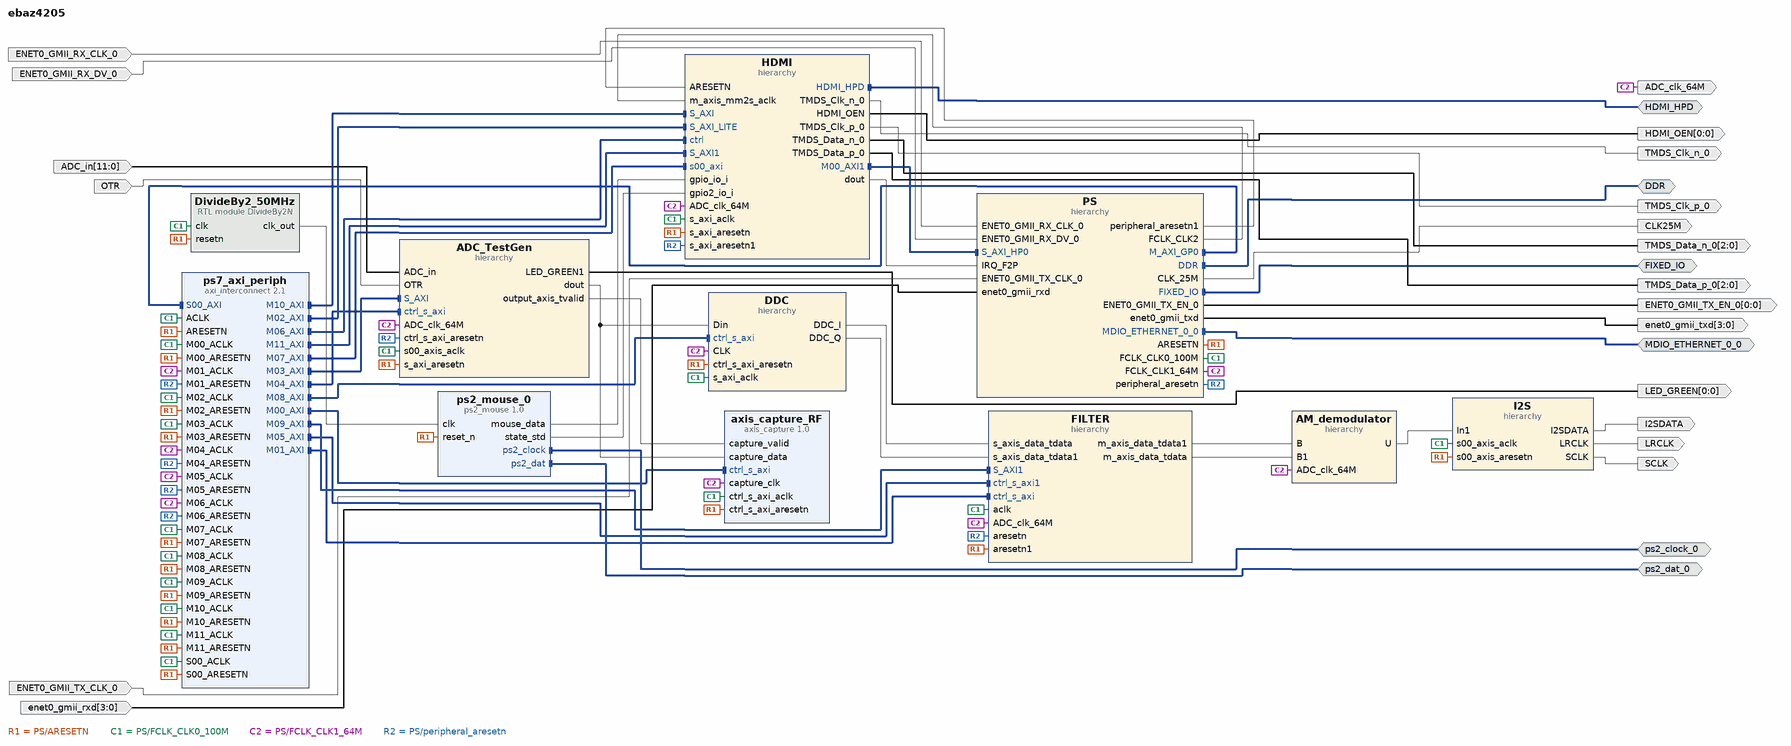
[diagram p0: block diagram of the top level]
# Vivado block design ebaz4205, xc7z010clg400-1, Vivado 2022.2
create_bd_design ebaz4205

create_bd_intf_port -mode Master -vlnv xilinx.com:interface:ddrx_rtl:1.0 DDR
create_bd_intf_port -mode Master -vlnv xilinx.com:display_processing_system7:fixedio_rtl:1.0 FIXED_IO
create_bd_intf_port -mode Master -vlnv xilinx.com:interface:mdio_rtl:1.0 MDIO_ETHERNET_0_0
create_bd_intf_port -mode Master -vlnv xilinx.com:interface:gpio_rtl:1.0 HDMI_HPD
create_bd_intf_port -mode Master -vlnv xilinx.com:interface:gpio_rtl:1.0 ps2_clock_0
create_bd_intf_port -mode Master -vlnv xilinx.com:interface:gpio_rtl:1.0 ps2_dat_0
create_bd_port -dir I -type clk ENET0_GMII_RX_CLK_0
create_bd_port -dir I ENET0_GMII_RX_DV_0
create_bd_port -dir I -type clk ENET0_GMII_TX_CLK_0
create_bd_port -dir O -from 0 -to 0 ENET0_GMII_TX_EN_0
create_bd_port -dir I -from 3 -to 0 enet0_gmii_rxd
create_bd_port -dir O -from 3 -to 0 enet0_gmii_txd
create_bd_port -dir O -type clk CLK25M
set_property -dict {CONFIG.FREQ_HZ 25000000} [get_bd_ports CLK25M]
create_bd_port -dir O -type clk ADC_clk_64M
set_property -dict {CONFIG.FREQ_HZ 64000000} [get_bd_ports ADC_clk_64M]
create_bd_port -dir I -type data OTR
create_bd_port -dir I -from 11 -to 0 -type data ADC_in
create_bd_port -dir O SCLK
create_bd_port -dir O LRCLK
create_bd_port -dir O I2SDATA
create_bd_port -dir O -from 0 -to 0 -type data LED_GREEN
create_bd_port -dir O -from 0 -to 0 HDMI_OEN
create_bd_port -dir O TMDS_Clk_p_0
create_bd_port -dir O TMDS_Clk_n_0
create_bd_port -dir O -from 2 -to 0 TMDS_Data_p_0
create_bd_port -dir O -from 2 -to 0 TMDS_Data_n_0

create_bd_cell -type hier PS
create_bd_cell -type hier ADC_TestGen
create_bd_cell -type hier DDC
create_bd_cell -type hier AM_demodulator
create_bd_cell -type hier FILTER
create_bd_cell -type hier I2S
create_bd_cell -type module -reference DivideBy2N DivideBy2_50MHz
set_property -dict {CONFIG.N 1 CONFIG.WIDTH 2} [get_bd_cells DivideBy2_50MHz]
create_bd_cell -type hier HDMI
create_bd_cell -type ip -vlnv xilinx.com:ip:axi_interconnect:2.1 ps7_axi_periph
set_property -dict [list \
  CONFIG.ENABLE_ADVANCED_OPTIONS 0 \
  CONFIG.NUM_MI 12 \
  CONFIG.NUM_SI 1 \
  CONFIG.STRATEGY 1 \
] [get_bd_cells ps7_axi_periph]
create_bd_cell -type ip -vlnv xilinx.com:user:axis_capture:1.0 axis_capture_RF
set_property -dict {CONFIG.C_CAPTURE_NUM_WORDS_EXP2 14} [get_bd_cells axis_capture_RF]
create_bd_cell -type ip -vlnv xilinx.com:user:ps2_mouse:1.0 ps2_mouse_0

# ---- hierarchy /PS ----
current_bd_instance /PS
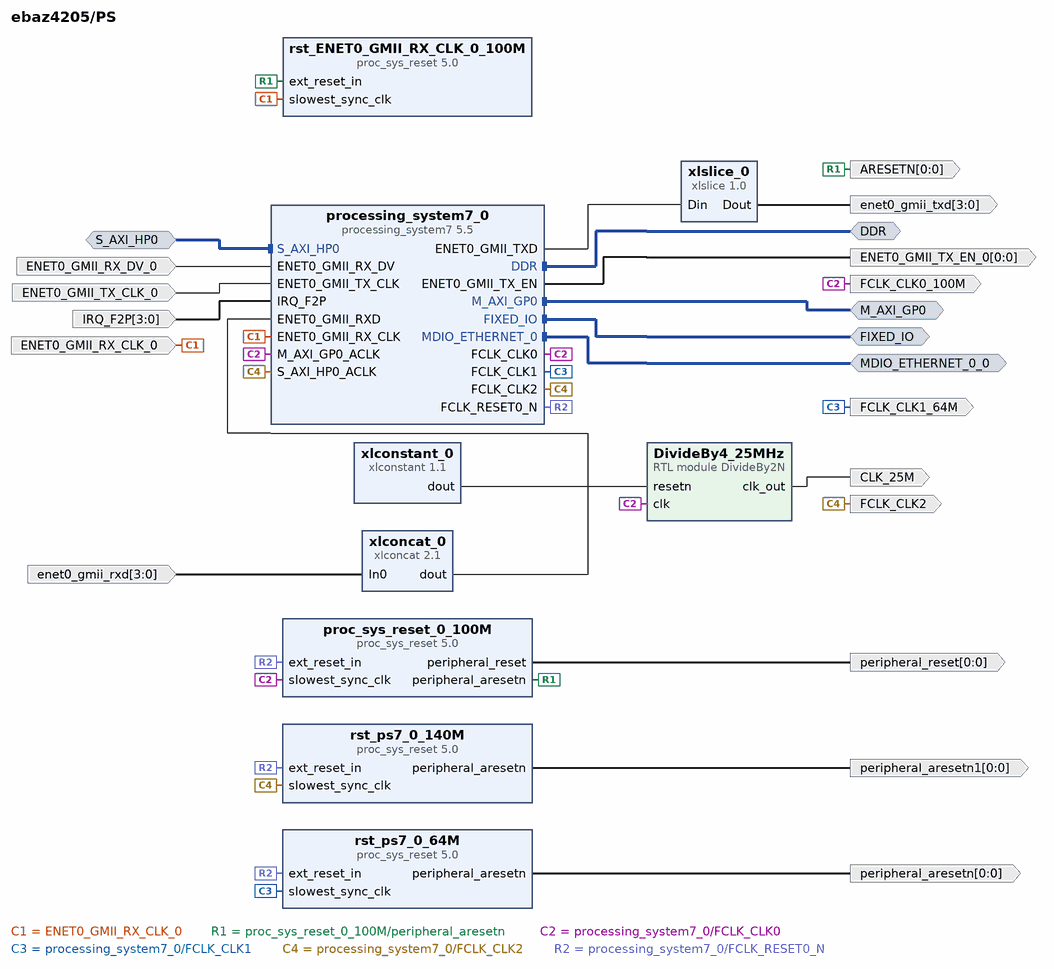
[diagram p1: block diagram inside /PS]
create_bd_intf_pin -mode Master -vlnv xilinx.com:interface:mdio_rtl:1.0 MDIO_ETHERNET_0_0
create_bd_intf_pin -mode Master -vlnv xilinx.com:interface:ddrx_rtl:1.0 DDR
create_bd_intf_pin -mode Master -vlnv xilinx.com:display_processing_system7:fixedio_rtl:1.0 FIXED_IO
create_bd_intf_pin -mode Slave -vlnv xilinx.com:interface:aximm_rtl:1.0 S_AXI_HP0
create_bd_intf_pin -mode Master -vlnv xilinx.com:interface:aximm_rtl:1.0 M_AXI_GP0
create_bd_pin -dir O -from 0 -to 0 ENET0_GMII_TX_EN_0
create_bd_pin -dir I -type clk ENET0_GMII_RX_CLK_0
create_bd_pin -dir I ENET0_GMII_RX_DV_0
create_bd_pin -dir I -type clk ENET0_GMII_TX_CLK_0
create_bd_pin -dir O -type clk FCLK_CLK0_100M
create_bd_pin -dir O -type clk CLK_25M
create_bd_pin -dir O -from 3 -to 0 enet0_gmii_txd
create_bd_pin -dir O -from 0 -to 0 -type rst ARESETN
create_bd_pin -dir I -from 3 -to 0 enet0_gmii_rxd
create_bd_pin -dir O -type clk FCLK_CLK1_64M
create_bd_pin -dir O -from 0 -to 0 -type rst peripheral_reset
create_bd_pin -dir O -from 0 -to 0 -type rst peripheral_aresetn
create_bd_pin -dir O -type clk FCLK_CLK2
create_bd_pin -dir O -from 0 -to 0 -type rst peripheral_aresetn1
create_bd_pin -dir I -from 3 -to 0 -type intr IRQ_F2P

create_bd_cell -type ip -vlnv xilinx.com:ip:xlslice:1.0 xlslice_0
set_property -dict {CONFIG.DIN_FROM 3 CONFIG.DIN_TO 0 CONFIG.DIN_WIDTH 8 CONFIG.DOUT_WIDTH 4} [get_bd_cells xlslice_0]
create_bd_cell -type ip -vlnv xilinx.com:ip:proc_sys_reset:5.0 proc_sys_reset_0_100M
create_bd_cell -type ip -vlnv xilinx.com:ip:processing_system7:5.5 processing_system7_0
set_property -dict [list \
  CONFIG.PCW_ENET0_ENET0_IO EMIO \
  CONFIG.PCW_ENET0_GRP_MDIO_ENABLE 1 \
  CONFIG.PCW_ENET0_GRP_MDIO_IO EMIO \
  CONFIG.PCW_ENET0_PERIPHERAL_ENABLE 1 \
  CONFIG.PCW_ENET0_PERIPHERAL_FREQMHZ {100 Mbps} \
  CONFIG.PCW_ENET0_RESET_ENABLE 0 \
  CONFIG.PCW_ENET_RESET_ENABLE 1 \
  CONFIG.PCW_ENET_RESET_SELECT {Share reset pin} \
  CONFIG.PCW_EN_CLK1_PORT 1 \
  CONFIG.PCW_EN_CLK2_PORT 1 \
  CONFIG.PCW_EN_CLK3_PORT 1 \
  CONFIG.PCW_FCLK_CLK1_BUF TRUE \
  CONFIG.PCW_FCLK_CLK2_BUF TRUE \
  CONFIG.PCW_FCLK_CLK3_BUF TRUE \
  CONFIG.PCW_FPGA0_PERIPHERAL_FREQMHZ 100 \
  CONFIG.PCW_FPGA1_PERIPHERAL_FREQMHZ 64 \
  CONFIG.PCW_FPGA2_PERIPHERAL_FREQMHZ 142 \
  CONFIG.PCW_FPGA3_PERIPHERAL_FREQMHZ 25 \
  CONFIG.PCW_FPGA_FCLK1_ENABLE 1 \
  CONFIG.PCW_FPGA_FCLK2_ENABLE 1 \
  CONFIG.PCW_FPGA_FCLK3_ENABLE 1 \
  CONFIG.PCW_GPIO_EMIO_GPIO_ENABLE 1 \
  CONFIG.PCW_GPIO_EMIO_GPIO_IO 64 \
  CONFIG.PCW_GPIO_MIO_GPIO_ENABLE 1 \
  CONFIG.PCW_GPIO_MIO_GPIO_IO MIO \
  CONFIG.PCW_I2C_RESET_ENABLE 1 \
  CONFIG.PCW_IRQ_F2P_INTR 1 \
  CONFIG.PCW_NAND_NAND_IO {MIO 0 2.. 14} \
  CONFIG.PCW_NAND_PERIPHERAL_ENABLE 1 \
  CONFIG.PCW_SD0_GRP_CD_ENABLE 1 \
  CONFIG.PCW_SD0_GRP_CD_IO {MIO 34} \
  CONFIG.PCW_SD0_GRP_WP_ENABLE 0 \
  CONFIG.PCW_SD0_PERIPHERAL_ENABLE 1 \
  CONFIG.PCW_SD0_SD0_IO {MIO 40 .. 45} \
  CONFIG.PCW_SDIO_PERIPHERAL_FREQMHZ 25 \
  CONFIG.PCW_UART1_PERIPHERAL_ENABLE 1 \
  CONFIG.PCW_UART1_UART1_IO {MIO 24 .. 25} \
  CONFIG.PCW_UART_PERIPHERAL_FREQMHZ 100 \
  CONFIG.PCW_UIPARAM_DDR_BUS_WIDTH {16 Bit} \
  CONFIG.PCW_UIPARAM_DDR_PARTNO {MT41K128M16 JT-125} \
  CONFIG.PCW_USB_RESET_ENABLE 1 \
  CONFIG.PCW_USE_FABRIC_INTERRUPT 1 \
  CONFIG.PCW_USE_S_AXI_HP0 1 \
] [get_bd_cells processing_system7_0]
# 212 more settings of processing_system7_0 are not shown: defaults, MIO pin electricals, DDR timing, and values the tool derives
create_bd_cell -type ip -vlnv xilinx.com:ip:xlconcat:2.1 xlconcat_0
set_property -dict {CONFIG.IN0_WIDTH 4 CONFIG.IN1_WIDTH 4 CONFIG.NUM_PORTS 2} [get_bd_cells xlconcat_0]
create_bd_cell -type ip -vlnv xilinx.com:ip:proc_sys_reset:5.0 rst_ENET0_GMII_RX_CLK_0_100M
create_bd_cell -type module -reference DivideBy2N DivideBy4_25MHz
set_property -dict {CONFIG.N 2 CONFIG.WIDTH 2} [get_bd_cells DivideBy4_25MHz]
create_bd_cell -type ip -vlnv xilinx.com:ip:proc_sys_reset:5.0 rst_ps7_0_64M
create_bd_cell -type ip -vlnv xilinx.com:ip:proc_sys_reset:5.0 rst_ps7_0_140M
create_bd_cell -type ip -vlnv xilinx.com:ip:xlconstant:1.1 xlconstant_0

# ---- hierarchy /ADC_TestGen ----
current_bd_instance /ADC_TestGen
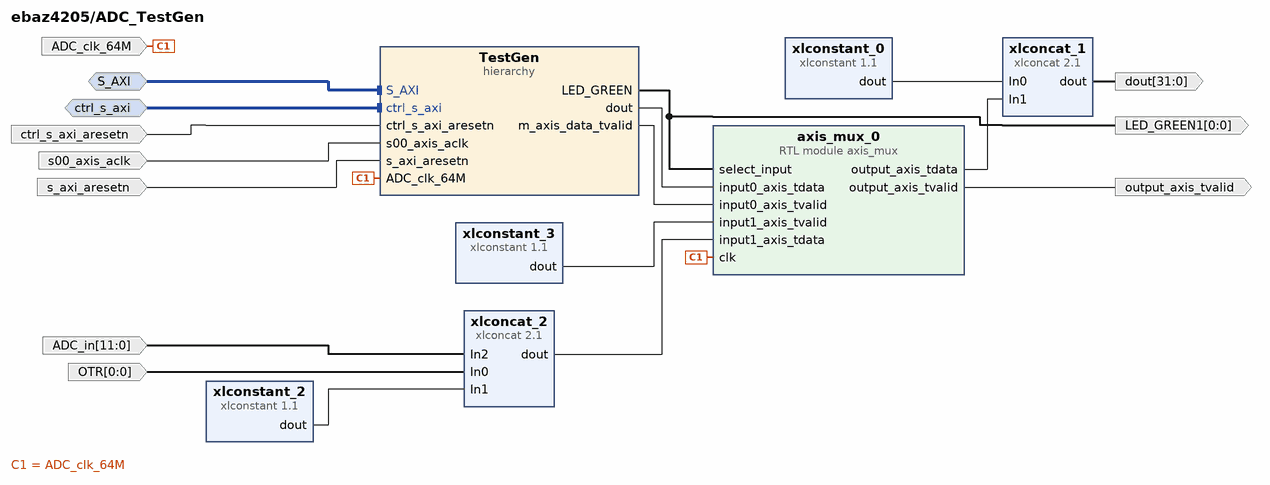
[diagram p2: block diagram inside /ADC_TestGen]
create_bd_intf_pin -mode Slave -vlnv xilinx.com:interface:aximm_rtl:1.0 S_AXI
create_bd_intf_pin -mode Slave -vlnv xilinx.com:interface:aximm_rtl:1.0 ctrl_s_axi
create_bd_pin -dir O -from 31 -to 0 dout
create_bd_pin -dir O output_axis_tvalid
create_bd_pin -dir I -type clk ADC_clk_64M
create_bd_pin -dir I -from 0 -to 0 -type data OTR
create_bd_pin -dir I -from 11 -to 0 -type data ADC_in
create_bd_pin -dir I -type clk s00_axis_aclk
create_bd_pin -dir I -type rst s_axi_aresetn
create_bd_pin -dir O -from 0 -to 0 LED_GREEN1
create_bd_pin -dir I -type rst ctrl_s_axi_aresetn

create_bd_cell -type ip -vlnv xilinx.com:ip:xlconcat:2.1 xlconcat_1
set_property -dict {CONFIG.IN0_WIDTH 16 CONFIG.IN1_WIDTH 16} [get_bd_cells xlconcat_1]
create_bd_cell -type module -reference axis_mux axis_mux_0
create_bd_cell -type ip -vlnv xilinx.com:ip:xlconcat:2.1 xlconcat_2
set_property -dict {CONFIG.IN0_WIDTH 1 CONFIG.IN1_WIDTH 3 CONFIG.IN2_WIDTH 12 CONFIG.NUM_PORTS 3} [get_bd_cells xlconcat_2]
create_bd_cell -type hier TestGen
create_bd_cell -type ip -vlnv xilinx.com:ip:xlconstant:1.1 xlconstant_0
set_property -dict {CONFIG.CONST_VAL 0 CONFIG.CONST_WIDTH 16} [get_bd_cells xlconstant_0]
create_bd_cell -type ip -vlnv xilinx.com:ip:xlconstant:1.1 xlconstant_3
set_property -dict {CONFIG.CONST_VAL 1 CONFIG.CONST_WIDTH 1} [get_bd_cells xlconstant_3]
create_bd_cell -type ip -vlnv xilinx.com:ip:xlconstant:1.1 xlconstant_2
set_property -dict {CONFIG.CONST_VAL b000 CONFIG.CONST_WIDTH 3} [get_bd_cells xlconstant_2]

# ---- hierarchy /ADC_TestGen/TestGen ----
current_bd_instance /ADC_TestGen/TestGen
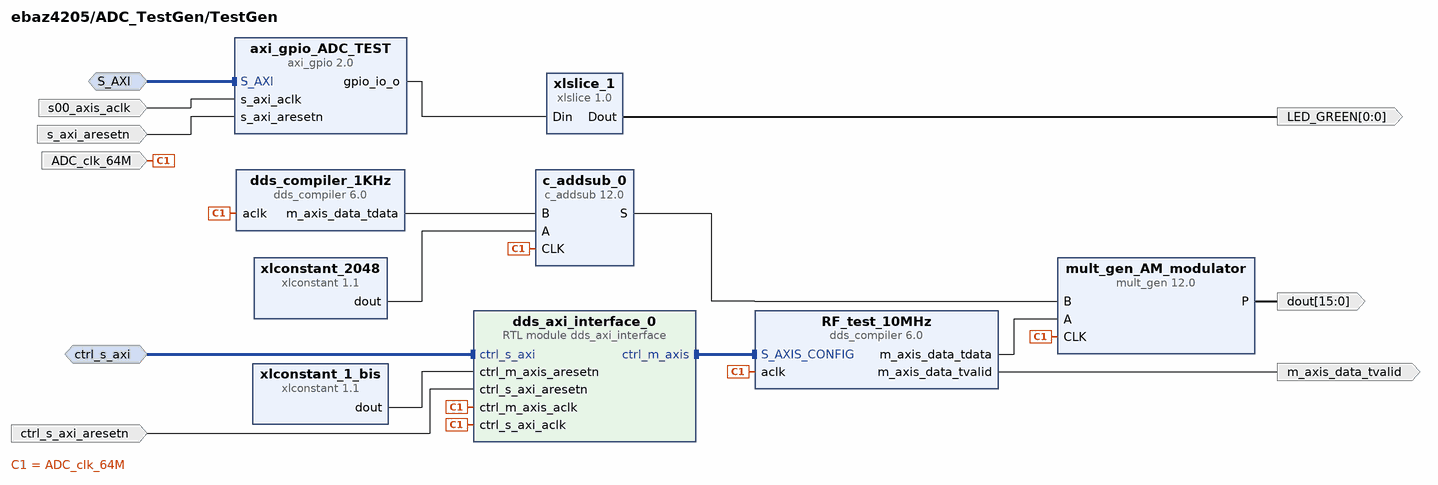
[diagram p3: block diagram inside /ADC_TestGen/TestGen]
create_bd_intf_pin -mode Slave -vlnv xilinx.com:interface:aximm_rtl:1.0 S_AXI
create_bd_intf_pin -mode Slave -vlnv xilinx.com:interface:aximm_rtl:1.0 ctrl_s_axi
create_bd_pin -dir I -type clk ADC_clk_64M
create_bd_pin -dir O m_axis_data_tvalid
create_bd_pin -dir I -type clk s00_axis_aclk
create_bd_pin -dir O -from 15 -to 0 dout
create_bd_pin -dir I -type rst s_axi_aresetn
create_bd_pin -dir O -from 0 -to 0 LED_GREEN
create_bd_pin -dir I -type rst ctrl_s_axi_aresetn

create_bd_cell -type ip -vlnv xilinx.com:ip:c_addsub:12.0 c_addsub_0
set_property -dict [list \
  CONFIG.A_Width 16 \
  CONFIG.B_Value 0000000000000000 \
  CONFIG.B_Width 16 \
  CONFIG.CE false \
  CONFIG.Latency 1 \
  CONFIG.Out_Width 16 \
] [get_bd_cells c_addsub_0]
create_bd_cell -type module -reference dds_axi_interface dds_axi_interface_0
create_bd_cell -type ip -vlnv xilinx.com:ip:xlslice:1.0 xlslice_1
create_bd_cell -type ip -vlnv xilinx.com:ip:axi_gpio:2.0 axi_gpio_ADC_TEST
set_property -dict [list \
  CONFIG.C_ALL_OUTPUTS 1 \
  CONFIG.C_DOUT_DEFAULT 0x00000000 \
  CONFIG.C_GPIO_WIDTH 32 \
  CONFIG.C_IS_DUAL 0 \
] [get_bd_cells axi_gpio_ADC_TEST]
create_bd_cell -type ip -vlnv xilinx.com:ip:dds_compiler:6.0 RF_test_10MHz
set_property -dict [list \
  CONFIG.DATA_Has_TLAST Not_Required \
  CONFIG.DDS_Clock_Rate 64 \
  CONFIG.Frequency_Resolution 1 \
  CONFIG.Has_Phase_Out false \
  CONFIG.Latency 7 \
  CONFIG.M_DATA_Has_TUSER Not_Required \
  CONFIG.Noise_Shaping Auto \
  CONFIG.OUTPUT_FORM Twos_Complement \
  CONFIG.Output_Frequency1 10 \
  CONFIG.Output_Selection Sine \
  CONFIG.Output_Width 12 \
  CONFIG.PINC1 101000000000000000000000 \
  CONFIG.Parameter_Entry System_Parameters \
  CONFIG.Phase_Increment Programmable \
  CONFIG.Phase_Width 26 \
  CONFIG.Phase_offset None \
  CONFIG.S_PHASE_Has_TUSER Not_Required \
  CONFIG.Spurious_Free_Dynamic_Range 70 \
] [get_bd_cells RF_test_10MHz]
create_bd_cell -type ip -vlnv xilinx.com:ip:dds_compiler:6.0 dds_compiler_1KHz
set_property -dict [list \
  CONFIG.Amplitude_Mode Full_Range \
  CONFIG.DDS_Clock_Rate 64 \
  CONFIG.Frequency_Resolution 0.4 \
  CONFIG.Has_Phase_Out false \
  CONFIG.Latency 7 \
  CONFIG.M_DATA_Has_TUSER Not_Required \
  CONFIG.Noise_Shaping Auto \
  CONFIG.Output_Frequency1 0.001 \
  CONFIG.Output_Selection Sine \
  CONFIG.Output_Width 12 \
  CONFIG.PINC1 1000001100010 \
  CONFIG.Parameter_Entry System_Parameters \
  CONFIG.Phase_Width 28 \
  CONFIG.Spurious_Free_Dynamic_Range 70 \
] [get_bd_cells dds_compiler_1KHz]
create_bd_cell -type ip -vlnv xilinx.com:ip:mult_gen:12.0 mult_gen_AM_modulator
set_property -dict [list \
  CONFIG.OptGoal Area \
  CONFIG.OutputWidthHigh 24 \
  CONFIG.OutputWidthLow 9 \
  CONFIG.PortAWidth 16 \
  CONFIG.PortBWidth 16 \
  CONFIG.Use_Custom_Output_Width true \
] [get_bd_cells mult_gen_AM_modulator]
create_bd_cell -type ip -vlnv xilinx.com:ip:xlconstant:1.1 xlconstant_1_bis
create_bd_cell -type ip -vlnv xilinx.com:ip:xlconstant:1.1 xlconstant_2048
set_property -dict {CONFIG.CONST_VAL 2048 CONFIG.CONST_WIDTH 16} [get_bd_cells xlconstant_2048]

# ---- hierarchy /DDC ----
current_bd_instance /DDC
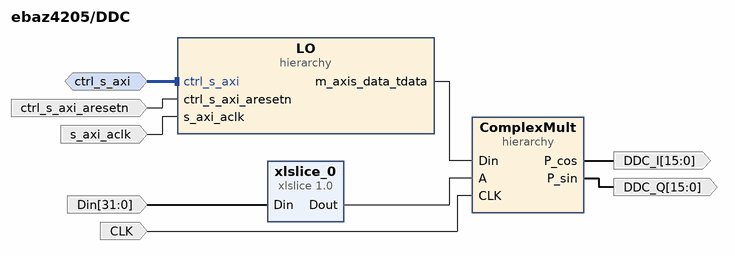
[diagram p4: block diagram inside /DDC]
create_bd_intf_pin -mode Slave -vlnv xilinx.com:interface:aximm_rtl:1.0 ctrl_s_axi
create_bd_pin -dir I -type clk CLK
create_bd_pin -dir O -from 15 -to 0 -type data DDC_I
create_bd_pin -dir O -from 15 -to 0 -type data DDC_Q
create_bd_pin -dir I -from 31 -to 0 Din
create_bd_pin -dir I -type clk s_axi_aclk
create_bd_pin -dir I -type rst ctrl_s_axi_aresetn

create_bd_cell -type hier LO
create_bd_cell -type hier ComplexMult
create_bd_cell -type ip -vlnv xilinx.com:ip:xlslice:1.0 xlslice_0
set_property -dict {CONFIG.DIN_FROM 31 CONFIG.DIN_TO 20 CONFIG.DOUT_WIDTH 12} [get_bd_cells xlslice_0]

# ---- hierarchy /DDC/LO ----
current_bd_instance /DDC/LO
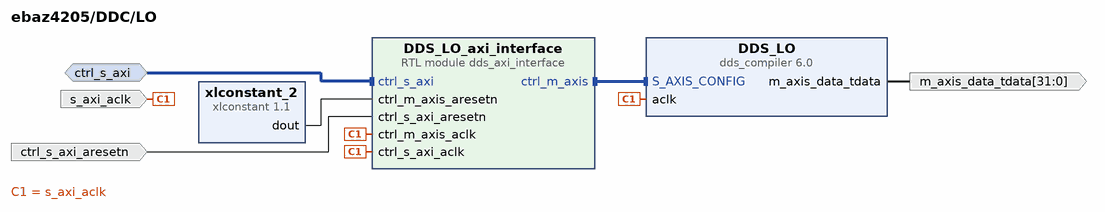
[diagram p5: block diagram inside /DDC/LO]
create_bd_intf_pin -mode Slave -vlnv xilinx.com:interface:aximm_rtl:1.0 ctrl_s_axi
create_bd_pin -dir I -type clk s_axi_aclk
create_bd_pin -dir O -from 31 -to 0 m_axis_data_tdata
create_bd_pin -dir I -type rst ctrl_s_axi_aresetn

create_bd_cell -type module -reference dds_axi_interface DDS_LO_axi_interface
create_bd_cell -type ip -vlnv xilinx.com:ip:dds_compiler:6.0 DDS_LO
set_property -dict [list \
  CONFIG.DATA_Has_TLAST Not_Required \
  CONFIG.DDS_Clock_Rate 100 \
  CONFIG.Frequency_Resolution 1 \
  CONFIG.Has_Phase_Out false \
  CONFIG.Latency 8 \
  CONFIG.M_DATA_Has_TUSER Not_Required \
  CONFIG.Noise_Shaping Auto \
  CONFIG.OUTPUT_FORM Twos_Complement \
  CONFIG.Output_Frequency1 10.010 \
  CONFIG.Output_Selection Sine_and_Cosine \
  CONFIG.Output_Width 16 \
  CONFIG.PINC1 110011010000000100111010 \
  CONFIG.Parameter_Entry System_Parameters \
  CONFIG.Phase_Increment Programmable \
  CONFIG.Phase_Width 27 \
  CONFIG.Phase_offset None \
  CONFIG.S_PHASE_Has_TUSER Not_Required \
  CONFIG.Spurious_Free_Dynamic_Range 95 \
] [get_bd_cells DDS_LO]
create_bd_cell -type ip -vlnv xilinx.com:ip:xlconstant:1.1 xlconstant_2

# ---- hierarchy /DDC/ComplexMult ----
current_bd_instance /DDC/ComplexMult
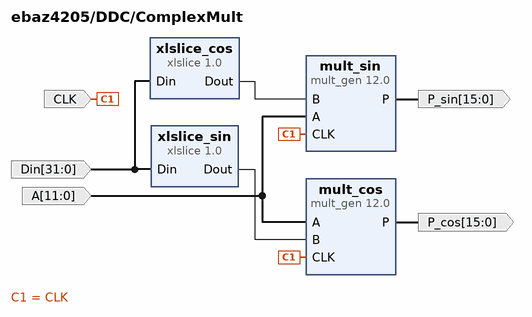
[diagram p6: block diagram inside /DDC/ComplexMult]
create_bd_pin -dir I -from 31 -to 0 Din
create_bd_pin -dir I -type clk CLK
create_bd_pin -dir I -from 11 -to 0 -type data A
create_bd_pin -dir O -from 15 -to 0 -type data P_cos
create_bd_pin -dir O -from 15 -to 0 -type data P_sin

create_bd_cell -type ip -vlnv xilinx.com:ip:xlslice:1.0 xlslice_sin
set_property -dict {CONFIG.DIN_FROM 31 CONFIG.DIN_TO 16 CONFIG.DOUT_WIDTH 16} [get_bd_cells xlslice_sin]
create_bd_cell -type ip -vlnv xilinx.com:ip:xlslice:1.0 xlslice_cos
set_property -dict {CONFIG.DIN_FROM 15 CONFIG.DIN_TO 0 CONFIG.DOUT_WIDTH 16} [get_bd_cells xlslice_cos]
create_bd_cell -type ip -vlnv xilinx.com:ip:mult_gen:12.0 mult_sin
set_property -dict [list \
  CONFIG.OutputWidthHigh 26 \
  CONFIG.OutputWidthLow 11 \
  CONFIG.PortAWidth 12 \
  CONFIG.PortBWidth 16 \
  CONFIG.Use_Custom_Output_Width true \
] [get_bd_cells mult_sin]
create_bd_cell -type ip -vlnv xilinx.com:ip:mult_gen:12.0 mult_cos
set_property -dict [list \
  CONFIG.MultType Parallel_Multiplier \
  CONFIG.OutputWidthHigh 26 \
  CONFIG.OutputWidthLow 11 \
  CONFIG.PortAWidth 12 \
  CONFIG.PortBWidth 16 \
  CONFIG.Use_Custom_Output_Width true \
] [get_bd_cells mult_cos]

# ---- hierarchy /AM_demodulator ----
current_bd_instance /AM_demodulator
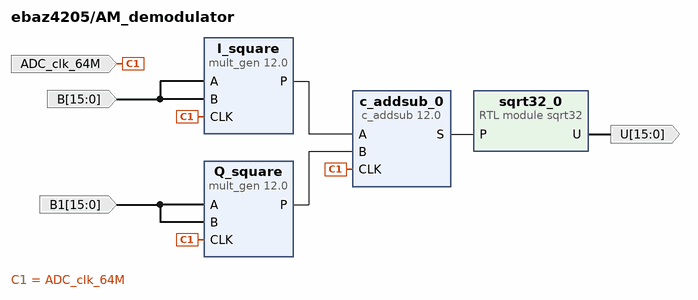
[diagram p7: block diagram inside /AM_demodulator]
create_bd_pin -dir I -type clk ADC_clk_64M
create_bd_pin -dir I -from 15 -to 0 -type data B
create_bd_pin -dir I -from 15 -to 0 -type data B1
create_bd_pin -dir O -from 15 -to 0 U

create_bd_cell -type module -reference sqrt32 sqrt32_0
create_bd_cell -type ip -vlnv xilinx.com:ip:c_addsub:12.0 c_addsub_0
set_property -dict [list \
  CONFIG.A_Type Signed \
  CONFIG.A_Width 32 \
  CONFIG.B_Type Signed \
  CONFIG.B_Value 00000000000000000000000000000000 \
  CONFIG.B_Width 32 \
  CONFIG.CE false \
  CONFIG.Latency 1 \
  CONFIG.Out_Width 32 \
] [get_bd_cells c_addsub_0]
create_bd_cell -type ip -vlnv xilinx.com:ip:mult_gen:12.0 I_square
set_property -dict {CONFIG.PortAType Signed CONFIG.PortAWidth 16 CONFIG.PortBWidth 16} [get_bd_cells I_square]
create_bd_cell -type ip -vlnv xilinx.com:ip:mult_gen:12.0 Q_square
set_property -dict {CONFIG.PortAWidth 16 CONFIG.PortBWidth 16} [get_bd_cells Q_square]

# ---- hierarchy /FILTER ----
current_bd_instance /FILTER
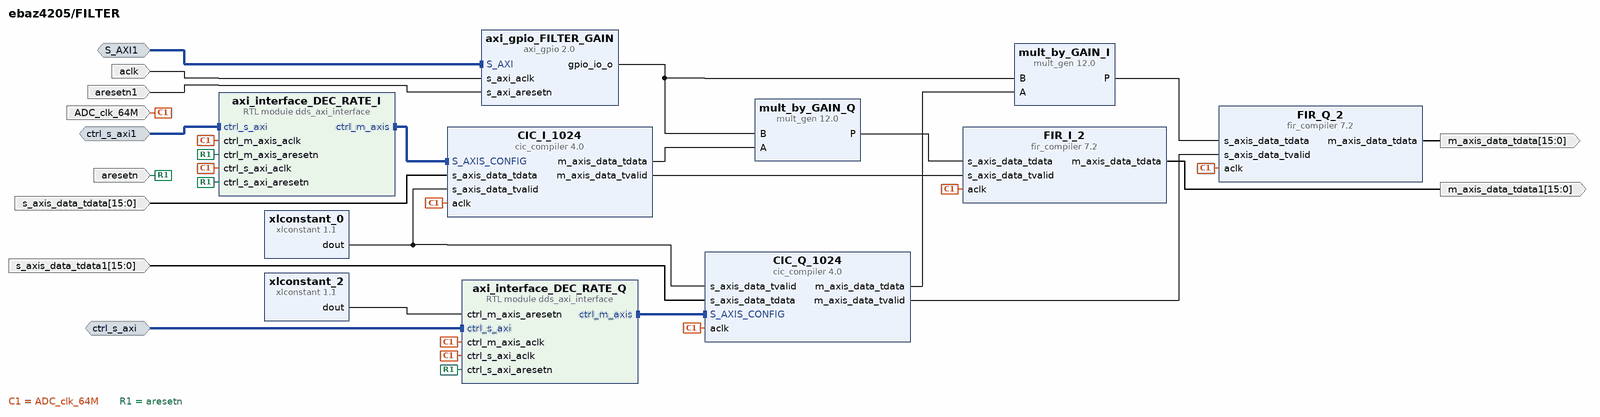
[diagram p8: block diagram inside /FILTER]
create_bd_intf_pin -mode Slave -vlnv xilinx.com:interface:aximm_rtl:1.0 S_AXI1
create_bd_intf_pin -mode Slave -vlnv xilinx.com:interface:aximm_rtl:1.0 ctrl_s_axi
create_bd_intf_pin -mode Slave -vlnv xilinx.com:interface:aximm_rtl:1.0 ctrl_s_axi1
create_bd_pin -dir I -type clk ADC_clk_64M
create_bd_pin -dir I -type rst aresetn
create_bd_pin -dir O -from 15 -to 0 m_axis_data_tdata
create_bd_pin -dir I -from 15 -to 0 s_axis_data_tdata
create_bd_pin -dir I -from 15 -to 0 s_axis_data_tdata1
create_bd_pin -dir O -from 15 -to 0 m_axis_data_tdata1
create_bd_pin -dir I -type clk aclk
create_bd_pin -dir I -type rst aresetn1

create_bd_cell -type module -reference dds_axi_interface axi_interface_DEC_RATE_Q
set_property -dict [list \
  CONFIG.C_CTRL_M_AXIS_TDATA_WIDTH 16 \
  CONFIG.C_CTRL_M_AXIS_TDATA_WIDTH_INTERN 32 \
  CONFIG.C_CTRL_S_AXI_DATA_WIDTH 32 \
] [get_bd_cells axi_interface_DEC_RATE_Q]
create_bd_cell -type module -reference dds_axi_interface axi_interface_DEC_RATE_I
set_property -dict [list \
  CONFIG.C_CTRL_M_AXIS_TDATA_WIDTH 16 \
  CONFIG.C_CTRL_M_AXIS_TDATA_WIDTH_INTERN 32 \
  CONFIG.C_CTRL_S_AXI_DATA_WIDTH 32 \
] [get_bd_cells axi_interface_DEC_RATE_I]
create_bd_cell -type ip -vlnv xilinx.com:ip:axi_gpio:2.0 axi_gpio_FILTER_GAIN
set_property -dict {CONFIG.C_ALL_OUTPUTS 1} [get_bd_cells axi_gpio_FILTER_GAIN]
create_bd_cell -type ip -vlnv xilinx.com:ip:cic_compiler:4.0 CIC_I_1024
set_property -dict [list \
  CONFIG.Clock_Frequency 64 \
  CONFIG.Filter_Type Decimation \
  CONFIG.Fixed_Or_Initial_Rate 1024 \
  CONFIG.HAS_DOUT_TREADY false \
  CONFIG.Input_Data_Width 16 \
  CONFIG.Input_Sample_Frequency 64 \
  CONFIG.Maximum_Rate 8192 \
  CONFIG.Minimum_Rate 4 \
  CONFIG.Number_Of_Channels 1 \
  CONFIG.Number_Of_Stages 6 \
  CONFIG.Output_Data_Width 16 \
  CONFIG.Quantization Truncation \
  CONFIG.Response_Magnitude Normalized \
  CONFIG.SamplePeriod 1 \
  CONFIG.Sample_Rate_Changes Programmable \
  CONFIG.Use_Xtreme_DSP_Slice false \
] [get_bd_cells CIC_I_1024]
create_bd_cell -type ip -vlnv xilinx.com:ip:cic_compiler:4.0 CIC_Q_1024
set_property -dict [list \
  CONFIG.Clock_Frequency 64 \
  CONFIG.Filter_Type Decimation \
  CONFIG.Fixed_Or_Initial_Rate 1024 \
  CONFIG.HAS_DOUT_TREADY false \
  CONFIG.Input_Data_Width 16 \
  CONFIG.Input_Sample_Frequency 64 \
  CONFIG.Maximum_Rate 8192 \
  CONFIG.Minimum_Rate 4 \
  CONFIG.Number_Of_Channels 1 \
  CONFIG.Number_Of_Stages 6 \
  CONFIG.Output_Data_Width 16 \
  CONFIG.Quantization Truncation \
  CONFIG.SamplePeriod 1 \
  CONFIG.Sample_Rate_Changes Programmable \
  CONFIG.Use_Xtreme_DSP_Slice false \
] [get_bd_cells CIC_Q_1024]
create_bd_cell -type ip -vlnv xilinx.com:ip:fir_compiler:7.2 FIR_I_2
set_property -dict [list \
  CONFIG.BestPrecision false \
  CONFIG.Channel_Sequence Basic \
  CONFIG.Clock_Frequency 64 \
  CONFIG.CoefficientSource COE_File \
  CONFIG.Coefficient_File ../../../../imports/EBAZ4205_SDR_HDMI/matlab/mycoefile.coe \
  CONFIG.Coefficient_Fractional_Bits 0 \
  CONFIG.Coefficient_Reload false \
  CONFIG.Coefficient_Sets 1 \
  CONFIG.Coefficient_Sign Signed \
  CONFIG.Coefficient_Structure Symmetric \
  CONFIG.Coefficient_Width 16 \
  CONFIG.ColumnConfig 28 \
  CONFIG.DATA_Has_TLAST Not_Required \
  CONFIG.Data_Fractional_Bits 0 \
  CONFIG.Data_Width 16 \
  CONFIG.Decimation_Rate 2 \
  CONFIG.Filter_Architecture Systolic_Multiply_Accumulate \
  CONFIG.Filter_Type Decimation \
  CONFIG.Interpolation_Rate 1 \
  CONFIG.M_DATA_Has_TUSER Not_Required \
  CONFIG.Number_Channels 1 \
  CONFIG.Output_Rounding_Mode Truncate_LSBs \
  CONFIG.Output_Width 16 \
  CONFIG.Quantization Maximize_Dynamic_Range \
  CONFIG.RateSpecification Frequency_Specification \
  CONFIG.S_DATA_Has_TUSER Not_Required \
  CONFIG.Sample_Frequency 64 \
  CONFIG.Select_Pattern All \
  CONFIG.Zero_Pack_Factor 1 \
] [get_bd_cells FIR_I_2]
create_bd_cell -type ip -vlnv xilinx.com:ip:fir_compiler:7.2 FIR_Q_2
set_property -dict [list \
  CONFIG.BestPrecision true \
  CONFIG.Channel_Sequence Basic \
  CONFIG.Clock_Frequency 64 \
  CONFIG.CoefficientSource COE_File \
  CONFIG.Coefficient_File ../../../../imports/EBAZ4205_SDR_HDMI/matlab/mycoefile.coe \
  CONFIG.Coefficient_Fractional_Bits 0 \
  CONFIG.Coefficient_Sets 1 \
  CONFIG.Coefficient_Sign Signed \
  CONFIG.Coefficient_Structure Symmetric \
  CONFIG.Coefficient_Width 16 \
  CONFIG.ColumnConfig 28 \
  CONFIG.DATA_Has_TLAST Not_Required \
  CONFIG.Data_Width 16 \
  CONFIG.Decimation_Rate 2 \
  CONFIG.Filter_Architecture Systolic_Multiply_Accumulate \
  CONFIG.Filter_Type Decimation \
  CONFIG.Interpolation_Rate 1 \
  CONFIG.M_DATA_Has_TUSER Not_Required \
  CONFIG.Number_Channels 1 \
  CONFIG.Output_Rounding_Mode Truncate_LSBs \
  CONFIG.Output_Width 16 \
  CONFIG.Quantization Maximize_Dynamic_Range \
  CONFIG.RateSpecification Frequency_Specification \
  CONFIG.S_DATA_Has_FIFO true \
  CONFIG.S_DATA_Has_TUSER Not_Required \
  CONFIG.Sample_Frequency 64 \
  CONFIG.Select_Pattern All \
  CONFIG.Zero_Pack_Factor 1 \
] [get_bd_cells FIR_Q_2]
create_bd_cell -type ip -vlnv xilinx.com:ip:mult_gen:12.0 mult_by_GAIN_Q
set_property -dict [list \
  CONFIG.MultType Parallel_Multiplier \
  CONFIG.OutputWidthHigh 15 \
  CONFIG.PipeStages 0 \
  CONFIG.PortAWidth 16 \
  CONFIG.PortBWidth 32 \
  CONFIG.Use_Custom_Output_Width true \
] [get_bd_cells mult_by_GAIN_Q]
create_bd_cell -type ip -vlnv xilinx.com:ip:mult_gen:12.0 mult_by_GAIN_I
set_property -dict [list \
  CONFIG.MultType Parallel_Multiplier \
  CONFIG.OutputWidthHigh 15 \
  CONFIG.PipeStages 0 \
  CONFIG.PortAWidth 16 \
  CONFIG.PortBWidth 32 \
  CONFIG.Use_Custom_Output_Width true \
] [get_bd_cells mult_by_GAIN_I]
create_bd_cell -type ip -vlnv xilinx.com:ip:xlconstant:1.1 xlconstant_0
create_bd_cell -type ip -vlnv xilinx.com:ip:xlconstant:1.1 xlconstant_2

# ---- hierarchy /I2S ----
current_bd_instance /I2S
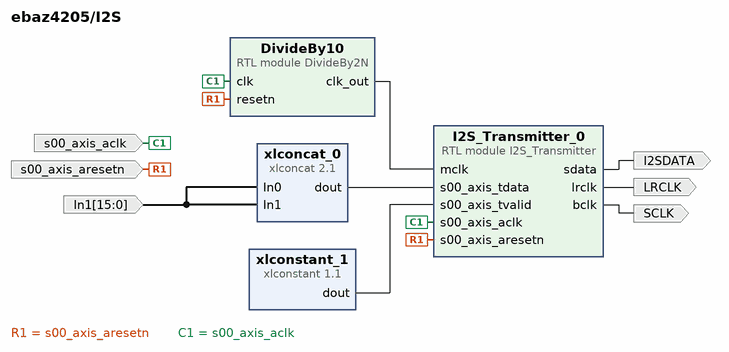
[diagram p9: block diagram inside /I2S]
create_bd_pin -dir I -from 15 -to 0 In1
create_bd_pin -dir I -type clk s00_axis_aclk
create_bd_pin -dir I -type rst s00_axis_aresetn
create_bd_pin -dir O SCLK
create_bd_pin -dir O LRCLK
create_bd_pin -dir O I2SDATA

create_bd_cell -type ip -vlnv xilinx.com:ip:xlconcat:2.1 xlconcat_0
set_property -dict {CONFIG.IN0_WIDTH 16 CONFIG.IN1_WIDTH 16} [get_bd_cells xlconcat_0]
create_bd_cell -type module -reference DivideBy2N DivideBy10
set_property -dict {CONFIG.N 5 CONFIG.WIDTH 3} [get_bd_cells DivideBy10]
create_bd_cell -type module -reference I2S_Transmitter I2S_Transmitter_0
create_bd_cell -type ip -vlnv xilinx.com:ip:xlconstant:1.1 xlconstant_1

# ---- hierarchy /HDMI ----
current_bd_instance /HDMI
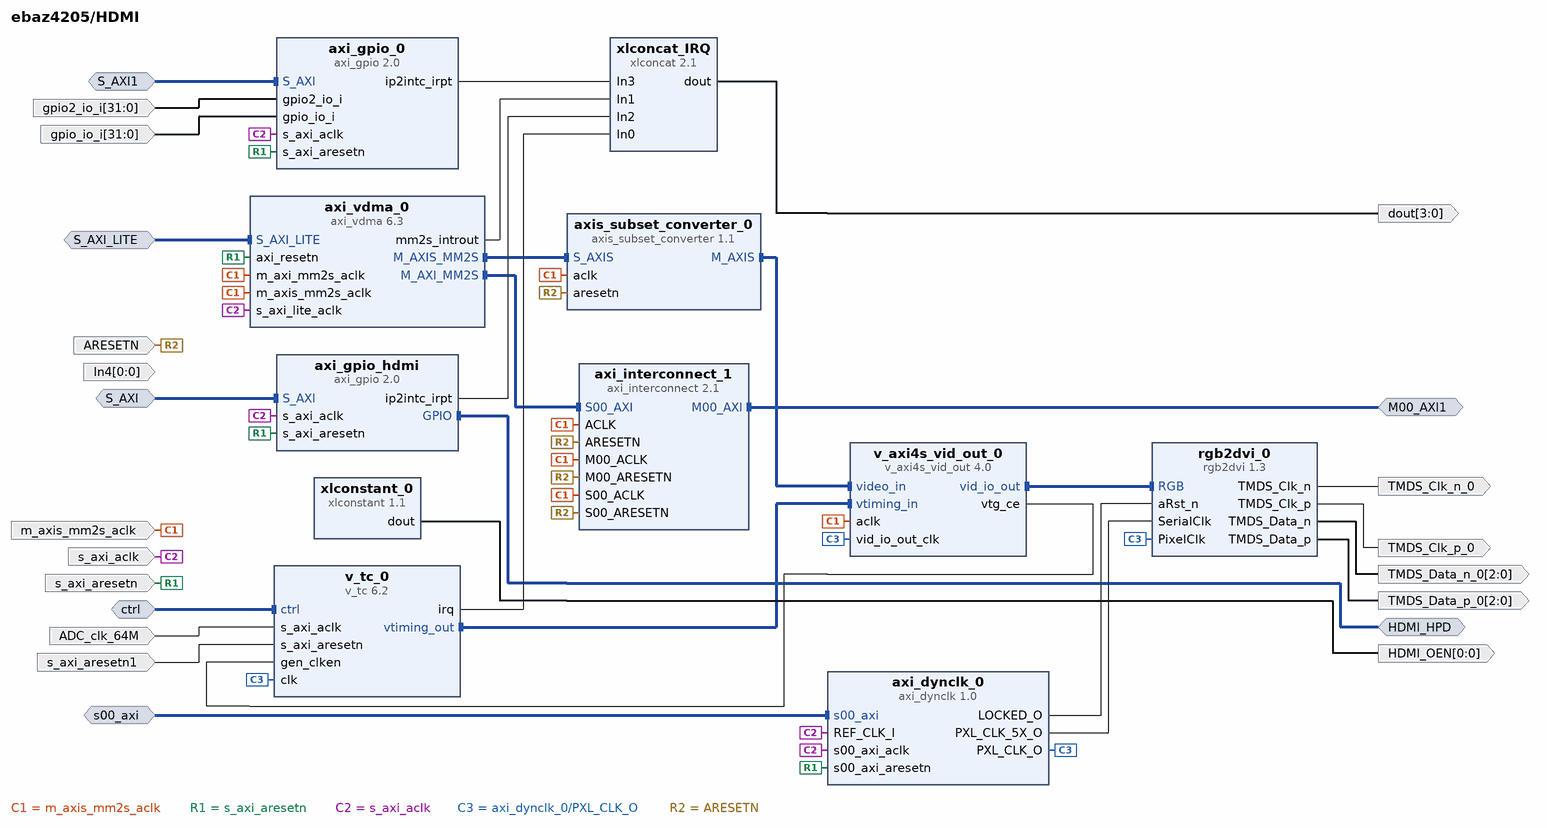
[diagram p10: block diagram inside /HDMI]
create_bd_intf_pin -mode Slave -vlnv xilinx.com:interface:aximm_rtl:1.0 S_AXI_LITE
create_bd_intf_pin -mode Slave -vlnv xilinx.com:interface:aximm_rtl:1.0 s00_axi
create_bd_intf_pin -mode Slave -vlnv xilinx.com:interface:aximm_rtl:1.0 S_AXI
create_bd_intf_pin -mode Master -vlnv xilinx.com:interface:gpio_rtl:1.0 HDMI_HPD
create_bd_intf_pin -mode Slave -vlnv xilinx.com:interface:aximm_rtl:1.0 ctrl
create_bd_intf_pin -mode Master -vlnv xilinx.com:interface:aximm_rtl:1.0 M00_AXI1
create_bd_intf_pin -mode Slave -vlnv xilinx.com:interface:aximm_rtl:1.0 S_AXI1
create_bd_pin -dir I -type clk s_axi_aclk
create_bd_pin -dir I -type clk m_axis_mm2s_aclk
create_bd_pin -dir I -type rst s_axi_aresetn
create_bd_pin -dir O -from 0 -to 0 HDMI_OEN
create_bd_pin -dir I -type rst ARESETN
create_bd_pin -dir I -type clk ADC_clk_64M
create_bd_pin -dir I -type rst s_axi_aresetn1
create_bd_pin -dir O TMDS_Clk_p_0
create_bd_pin -dir O TMDS_Clk_n_0
create_bd_pin -dir O -from 2 -to 0 TMDS_Data_p_0
create_bd_pin -dir O -from 2 -to 0 TMDS_Data_n_0
create_bd_pin -dir I -from 31 -to 0 gpio_io_i
create_bd_pin -dir I -from 31 -to 0 gpio2_io_i
create_bd_pin -dir I -from 0 -to 0 In4
create_bd_pin -dir O -from 3 -to 0 -type intr dout

create_bd_cell -type ip -vlnv digilentinc.com:ip:axi_dynclk:1.0 axi_dynclk_0
create_bd_cell -type ip -vlnv digilentinc.com:ip:rgb2dvi:1.3 rgb2dvi_0
set_property -dict {CONFIG.kClkRange 2 CONFIG.kGenerateSerialClk false CONFIG.kRstActiveHigh false} [get_bd_cells rgb2dvi_0]
create_bd_cell -type ip -vlnv xilinx.com:ip:axi_gpio:2.0 axi_gpio_hdmi
set_property -dict {CONFIG.C_ALL_INPUTS 1 CONFIG.C_GPIO_WIDTH 1 CONFIG.C_INTERRUPT_PRESENT 1} [get_bd_cells axi_gpio_hdmi]
create_bd_cell -type ip -vlnv xilinx.com:ip:axi_vdma:6.3 axi_vdma_0
set_property -dict [list \
  CONFIG.c_include_s2mm 0 \
  CONFIG.c_m_axis_mm2s_tdata_width 32 \
  CONFIG.c_mm2s_linebuffer_depth 4096 \
  CONFIG.c_mm2s_max_burst_length 16 \
  CONFIG.c_num_fstores 3 \
] [get_bd_cells axi_vdma_0]
create_bd_cell -type ip -vlnv xilinx.com:ip:axis_subset_converter:1.1 axis_subset_converter_0
set_property -dict [list \
  CONFIG.M_HAS_TKEEP 1 \
  CONFIG.M_HAS_TLAST 1 \
  CONFIG.M_TDATA_NUM_BYTES 3 \
  CONFIG.M_TUSER_WIDTH 1 \
  CONFIG.S_HAS_TKEEP 1 \
  CONFIG.S_HAS_TLAST 1 \
  CONFIG.S_TDATA_NUM_BYTES 4 \
  CONFIG.S_TUSER_WIDTH 1 \
  CONFIG.TDATA_REMAP {tdata[23:16],tdata[7:0],tdata[15:8]} \
  CONFIG.TKEEP_REMAP {tkeep[2:0]} \
  CONFIG.TLAST_REMAP {tlast[0]} \
  CONFIG.TUSER_REMAP {tuser[0:0]} \
] [get_bd_cells axis_subset_converter_0]
create_bd_cell -type ip -vlnv xilinx.com:ip:v_tc:6.2 v_tc_0
set_property -dict {CONFIG.enable_detection false} [get_bd_cells v_tc_0]
create_bd_cell -type ip -vlnv xilinx.com:ip:xlconstant:1.1 xlconstant_0
create_bd_cell -type ip -vlnv xilinx.com:ip:xlconcat:2.1 xlconcat_IRQ
set_property -dict {CONFIG.NUM_PORTS 4} [get_bd_cells xlconcat_IRQ]
create_bd_cell -type ip -vlnv xilinx.com:ip:axi_interconnect:2.1 axi_interconnect_1
set_property -dict {CONFIG.NUM_MI 1 CONFIG.S00_HAS_DATA_FIFO 2 CONFIG.S00_HAS_REGSLICE 4} [get_bd_cells axi_interconnect_1]
create_bd_cell -type ip -vlnv xilinx.com:ip:v_axi4s_vid_out:4.0 v_axi4s_vid_out_0
set_property -dict {CONFIG.C_ADDR_WIDTH 12 CONFIG.C_HAS_ASYNC_CLK 1 CONFIG.C_VTG_MASTER_SLAVE 1} [get_bd_cells v_axi4s_vid_out_0]
create_bd_cell -type ip -vlnv xilinx.com:ip:axi_gpio:2.0 axi_gpio_0
set_property -dict [list \
  CONFIG.C_ALL_INPUTS 1 \
  CONFIG.C_ALL_INPUTS_2 1 \
  CONFIG.C_GPIO_WIDTH 32 \
  CONFIG.C_INTERRUPT_PRESENT 1 \
  CONFIG.C_IS_DUAL 1 \
] [get_bd_cells axi_gpio_0]

# ---- connections ----

current_bd_instance /PS
connect_bd_intf_net [get_bd_intf_pins M_AXI_GP0] [get_bd_intf_pins processing_system7_0/M_AXI_GP0]
connect_bd_intf_net [get_bd_intf_pins S_AXI_HP0] [get_bd_intf_pins processing_system7_0/S_AXI_HP0]
connect_bd_intf_net [get_bd_intf_pins DDR] [get_bd_intf_pins processing_system7_0/DDR]
connect_bd_intf_net [get_bd_intf_pins FIXED_IO] [get_bd_intf_pins processing_system7_0/FIXED_IO]
connect_bd_intf_net [get_bd_intf_pins MDIO_ETHERNET_0_0] [get_bd_intf_pins processing_system7_0/MDIO_ETHERNET_0]
connect_bd_net [get_bd_pins DivideBy4_25MHz/clk_out] [get_bd_pins CLK_25M]
connect_bd_net -net ENET0_GMII_RX_CLK_0_1 [get_bd_pins ENET0_GMII_RX_CLK_0] \
  [get_bd_pins processing_system7_0/ENET0_GMII_RX_CLK] [get_bd_pins rst_ENET0_GMII_RX_CLK_0_100M/slowest_sync_clk]
connect_bd_net -net ENET0_GMII_RX_DV_0_1 [get_bd_pins ENET0_GMII_RX_DV_0] [get_bd_pins processing_system7_0/ENET0_GMII_RX_DV]
connect_bd_net -net ENET0_GMII_TX_CLK_0_1 [get_bd_pins ENET0_GMII_TX_CLK_0] [get_bd_pins processing_system7_0/ENET0_GMII_TX_CLK]
connect_bd_net [get_bd_pins IRQ_F2P] [get_bd_pins processing_system7_0/IRQ_F2P]
connect_bd_net -net In0_0_1 [get_bd_pins enet0_gmii_rxd] [get_bd_pins xlconcat_0/In0]
connect_bd_net -net proc_sys_reset_0_peripheral_aresetn [get_bd_pins proc_sys_reset_0_100M/peripheral_aresetn] \
  [get_bd_pins ARESETN] [get_bd_pins rst_ENET0_GMII_RX_CLK_0_100M/ext_reset_in]
connect_bd_net -net proc_sys_reset_0_peripheral_reset [get_bd_pins proc_sys_reset_0_100M/peripheral_reset] [get_bd_pins peripheral_reset]
connect_bd_net [get_bd_pins processing_system7_0/ENET0_GMII_TXD] [get_bd_pins xlslice_0/Din]
connect_bd_net [get_bd_pins processing_system7_0/ENET0_GMII_TX_EN] [get_bd_pins ENET0_GMII_TX_EN_0]
connect_bd_net [get_bd_pins processing_system7_0/FCLK_CLK0] \
  [get_bd_pins FCLK_CLK0_100M] [get_bd_pins proc_sys_reset_0_100M/slowest_sync_clk] \
  [get_bd_pins processing_system7_0/M_AXI_GP0_ACLK] [get_bd_pins DivideBy4_25MHz/clk]
connect_bd_net [get_bd_pins processing_system7_0/FCLK_CLK1] [get_bd_pins FCLK_CLK1_64M] [get_bd_pins rst_ps7_0_64M/slowest_sync_clk]
connect_bd_net [get_bd_pins processing_system7_0/FCLK_CLK2] \
  [get_bd_pins processing_system7_0/S_AXI_HP0_ACLK] [get_bd_pins FCLK_CLK2] [get_bd_pins rst_ps7_0_140M/slowest_sync_clk]
connect_bd_net [get_bd_pins processing_system7_0/FCLK_RESET0_N] \
  [get_bd_pins proc_sys_reset_0_100M/ext_reset_in] [get_bd_pins rst_ps7_0_64M/ext_reset_in] \
  [get_bd_pins rst_ps7_0_140M/ext_reset_in]
connect_bd_net [get_bd_pins rst_ps7_0_140M/peripheral_aresetn] [get_bd_pins peripheral_aresetn1]
connect_bd_net [get_bd_pins rst_ps7_0_64M/peripheral_aresetn] [get_bd_pins peripheral_aresetn]
connect_bd_net [get_bd_pins xlconcat_0/dout] [get_bd_pins processing_system7_0/ENET0_GMII_RXD]
connect_bd_net [get_bd_pins xlconstant_0/dout] [get_bd_pins DivideBy4_25MHz/resetn]
connect_bd_net [get_bd_pins xlslice_0/Dout] [get_bd_pins enet0_gmii_txd]

current_bd_instance /ADC_TestGen
connect_bd_intf_net [get_bd_intf_pins S_AXI] [get_bd_intf_pins TestGen/S_AXI]
connect_bd_intf_net [get_bd_intf_pins ctrl_s_axi] [get_bd_intf_pins TestGen/ctrl_s_axi]
connect_bd_net [get_bd_pins ADC_in] [get_bd_pins xlconcat_2/In2]
connect_bd_net -net ADCandTestGen_output_axis_tvalid [get_bd_pins axis_mux_0/output_axis_tvalid] [get_bd_pins output_axis_tvalid]
connect_bd_net [get_bd_pins OTR] [get_bd_pins xlconcat_2/In0]
connect_bd_net -net PS_FCLK_CLK1 [get_bd_pins ADC_clk_64M] [get_bd_pins axis_mux_0/clk] [get_bd_pins TestGen/ADC_clk_64M]
connect_bd_net [get_bd_pins TestGen/LED_GREEN] [get_bd_pins LED_GREEN1] [get_bd_pins axis_mux_0/select_input]
connect_bd_net [get_bd_pins TestGen/dout] [get_bd_pins axis_mux_0/input0_axis_tdata]
connect_bd_net [get_bd_pins TestGen/m_axis_data_tvalid] [get_bd_pins axis_mux_0/input0_axis_tvalid]
connect_bd_net [get_bd_pins axis_mux_0/output_axis_tdata] [get_bd_pins xlconcat_1/In1]
connect_bd_net [get_bd_pins ctrl_s_axi_aresetn] [get_bd_pins TestGen/ctrl_s_axi_aresetn]
connect_bd_net [get_bd_pins s00_axis_aclk] [get_bd_pins TestGen/s00_axis_aclk]
connect_bd_net [get_bd_pins s_axi_aresetn] [get_bd_pins TestGen/s_axi_aresetn]
connect_bd_net [get_bd_pins xlconcat_1/dout] [get_bd_pins dout]
connect_bd_net [get_bd_pins xlconcat_2/dout] [get_bd_pins axis_mux_0/input1_axis_tdata]
connect_bd_net [get_bd_pins xlconstant_0/dout] [get_bd_pins xlconcat_1/In0]
connect_bd_net [get_bd_pins xlconstant_2/dout] [get_bd_pins xlconcat_2/In1]
connect_bd_net [get_bd_pins xlconstant_3/dout] [get_bd_pins axis_mux_0/input1_axis_tvalid]

current_bd_instance /ADC_TestGen/TestGen
connect_bd_intf_net [get_bd_intf_pins ctrl_s_axi] [get_bd_intf_pins dds_axi_interface_0/ctrl_s_axi]
connect_bd_intf_net [get_bd_intf_pins S_AXI] [get_bd_intf_pins axi_gpio_ADC_TEST/S_AXI]
connect_bd_intf_net [get_bd_intf_pins dds_axi_interface_0/ctrl_m_axis] [get_bd_intf_pins RF_test_10MHz/S_AXIS_CONFIG]
connect_bd_net -net PS_FCLK_CLK0 [get_bd_pins s00_axis_aclk] [get_bd_pins axi_gpio_ADC_TEST/s_axi_aclk]
connect_bd_net -net PS_FCLK_CLK1 [get_bd_pins ADC_clk_64M] \
  [get_bd_pins c_addsub_0/CLK] [get_bd_pins dds_axi_interface_0/ctrl_m_axis_aclk] \
  [get_bd_pins dds_axi_interface_0/ctrl_s_axi_aclk] [get_bd_pins RF_test_10MHz/aclk] [get_bd_pins dds_compiler_1KHz/aclk] \
  [get_bd_pins mult_gen_AM_modulator/CLK]
connect_bd_net -net RF_test_1MHz_m_axis_data_tdata [get_bd_pins RF_test_10MHz/m_axis_data_tdata] [get_bd_pins mult_gen_AM_modulator/A]
connect_bd_net -net RF_test_1MHz_m_axis_data_tvalid [get_bd_pins RF_test_10MHz/m_axis_data_tvalid] [get_bd_pins m_axis_data_tvalid]
connect_bd_net [get_bd_pins axi_gpio_ADC_TEST/gpio_io_o] [get_bd_pins xlslice_1/Din]
connect_bd_net [get_bd_pins c_addsub_0/S] [get_bd_pins mult_gen_AM_modulator/B]
connect_bd_net [get_bd_pins ctrl_s_axi_aresetn] [get_bd_pins dds_axi_interface_0/ctrl_s_axi_aresetn]
connect_bd_net [get_bd_pins dds_compiler_1KHz/m_axis_data_tdata] [get_bd_pins c_addsub_0/B]
connect_bd_net -net mult_gen_0_P [get_bd_pins mult_gen_AM_modulator/P] [get_bd_pins dout]
connect_bd_net [get_bd_pins s_axi_aresetn] [get_bd_pins axi_gpio_ADC_TEST/s_axi_aresetn]
connect_bd_net [get_bd_pins xlconstant_2048/dout] [get_bd_pins c_addsub_0/A]
connect_bd_net -net xlconstant_2_dout [get_bd_pins xlconstant_1_bis/dout] [get_bd_pins dds_axi_interface_0/ctrl_m_axis_aresetn]
connect_bd_net [get_bd_pins xlslice_1/Dout] [get_bd_pins LED_GREEN]

current_bd_instance /DDC
connect_bd_intf_net [get_bd_intf_pins ctrl_s_axi] [get_bd_intf_pins LO/ctrl_s_axi]
connect_bd_net -net A_1 [get_bd_pins xlslice_0/Dout] [get_bd_pins ComplexMult/A]
connect_bd_net [get_bd_pins CLK] [get_bd_pins ComplexMult/CLK]
connect_bd_net [get_bd_pins ComplexMult/P_cos] [get_bd_pins DDC_I]
connect_bd_net [get_bd_pins ComplexMult/P_sin] [get_bd_pins DDC_Q]
connect_bd_net [get_bd_pins Din] [get_bd_pins xlslice_0/Din]
connect_bd_net [get_bd_pins LO/m_axis_data_tdata] [get_bd_pins ComplexMult/Din]
connect_bd_net [get_bd_pins ctrl_s_axi_aresetn] [get_bd_pins LO/ctrl_s_axi_aresetn]
connect_bd_net [get_bd_pins s_axi_aclk] [get_bd_pins LO/s_axi_aclk]

current_bd_instance /DDC/LO
connect_bd_intf_net [get_bd_intf_pins ctrl_s_axi] [get_bd_intf_pins DDS_LO_axi_interface/ctrl_s_axi]
connect_bd_intf_net [get_bd_intf_pins DDS_LO_axi_interface/ctrl_m_axis] [get_bd_intf_pins DDS_LO/S_AXIS_CONFIG]
connect_bd_net -net LocalOscillator_m_axis_data_tdata [get_bd_pins DDS_LO/m_axis_data_tdata] [get_bd_pins m_axis_data_tdata]
connect_bd_net [get_bd_pins ctrl_s_axi_aresetn] [get_bd_pins DDS_LO_axi_interface/ctrl_s_axi_aresetn]
connect_bd_net [get_bd_pins s_axi_aclk] \
  [get_bd_pins DDS_LO_axi_interface/ctrl_m_axis_aclk] [get_bd_pins DDS_LO_axi_interface/ctrl_s_axi_aclk] \
  [get_bd_pins DDS_LO/aclk]
connect_bd_net [get_bd_pins xlconstant_2/dout] [get_bd_pins DDS_LO_axi_interface/ctrl_m_axis_aresetn]

current_bd_instance /DDC/ComplexMult
connect_bd_net [get_bd_pins A] [get_bd_pins mult_sin/A] [get_bd_pins mult_cos/A]
connect_bd_net [get_bd_pins CLK] [get_bd_pins mult_sin/CLK] [get_bd_pins mult_cos/CLK]
connect_bd_net -net LocalOscillator_m_axis_data_tdata [get_bd_pins Din] [get_bd_pins xlslice_cos/Din] [get_bd_pins xlslice_sin/Din]
connect_bd_net [get_bd_pins mult_cos/P] [get_bd_pins P_cos]
connect_bd_net [get_bd_pins mult_sin/P] [get_bd_pins P_sin]
connect_bd_net [get_bd_pins xlslice_cos/Dout] [get_bd_pins mult_sin/B]
connect_bd_net [get_bd_pins xlslice_sin/Dout] [get_bd_pins mult_cos/B]

current_bd_instance /AM_demodulator
connect_bd_net -net FIR_I_m_axis_data_tdata [get_bd_pins B] [get_bd_pins I_square/A] [get_bd_pins I_square/B]
connect_bd_net -net FIR_Q_m_axis_data_tdata [get_bd_pins B1] [get_bd_pins Q_square/A] [get_bd_pins Q_square/B]
connect_bd_net -net PS_FCLK_CLK1 [get_bd_pins ADC_clk_64M] [get_bd_pins c_addsub_0/CLK] [get_bd_pins I_square/CLK] [get_bd_pins Q_square/CLK]
connect_bd_net [get_bd_pins c_addsub_0/S] [get_bd_pins sqrt32_0/P]
connect_bd_net -net mult_gen_0_P [get_bd_pins I_square/P] [get_bd_pins c_addsub_0/A]
connect_bd_net -net mult_gen_1_P [get_bd_pins Q_square/P] [get_bd_pins c_addsub_0/B]
connect_bd_net [get_bd_pins sqrt32_0/U] [get_bd_pins U]

current_bd_instance /FILTER
connect_bd_intf_net [get_bd_intf_pins ctrl_s_axi] [get_bd_intf_pins axi_interface_DEC_RATE_Q/ctrl_s_axi]
connect_bd_intf_net [get_bd_intf_pins ctrl_s_axi1] [get_bd_intf_pins axi_interface_DEC_RATE_I/ctrl_s_axi]
connect_bd_intf_net [get_bd_intf_pins S_AXI1] [get_bd_intf_pins axi_gpio_FILTER_GAIN/S_AXI]
connect_bd_intf_net [get_bd_intf_pins axi_interface_DEC_RATE_Q/ctrl_m_axis] [get_bd_intf_pins CIC_Q_1024/S_AXIS_CONFIG]
connect_bd_intf_net [get_bd_intf_pins axi_interface_DEC_RATE_I/ctrl_m_axis] [get_bd_intf_pins CIC_I_1024/S_AXIS_CONFIG]
connect_bd_net -net CIC_I_128_m_axis_data_tdata [get_bd_pins CIC_I_1024/m_axis_data_tdata] [get_bd_pins mult_by_GAIN_Q/A]
connect_bd_net -net CIC_I_128_m_axis_data_tvalid [get_bd_pins CIC_I_1024/m_axis_data_tvalid] [get_bd_pins FIR_I_2/s_axis_data_tvalid]
connect_bd_net -net CIC_Q_128_m_axis_data_tdata [get_bd_pins CIC_Q_1024/m_axis_data_tdata] [get_bd_pins mult_by_GAIN_I/A]
connect_bd_net -net CIC_Q_128_m_axis_data_tvalid [get_bd_pins CIC_Q_1024/m_axis_data_tvalid] [get_bd_pins FIR_Q_2/s_axis_data_tvalid]
connect_bd_net -net DDC_I [get_bd_pins s_axis_data_tdata] [get_bd_pins CIC_I_1024/s_axis_data_tdata]
connect_bd_net -net DDC_Q [get_bd_pins s_axis_data_tdata1] [get_bd_pins CIC_Q_1024/s_axis_data_tdata]
connect_bd_net -net FIR_I_m_axis_data_tdata [get_bd_pins FIR_I_2/m_axis_data_tdata] [get_bd_pins m_axis_data_tdata1]
connect_bd_net -net FIR_Q_m_axis_data_tdata [get_bd_pins FIR_Q_2/m_axis_data_tdata] [get_bd_pins m_axis_data_tdata]
connect_bd_net -net PS_FCLK_CLK1 [get_bd_pins ADC_clk_64M] \
  [get_bd_pins axi_interface_DEC_RATE_Q/ctrl_m_axis_aclk] [get_bd_pins axi_interface_DEC_RATE_Q/ctrl_s_axi_aclk] \
  [get_bd_pins axi_interface_DEC_RATE_I/ctrl_m_axis_aclk] [get_bd_pins axi_interface_DEC_RATE_I/ctrl_s_axi_aclk] \
  [get_bd_pins CIC_I_1024/aclk] [get_bd_pins CIC_Q_1024/aclk] [get_bd_pins FIR_I_2/aclk] [get_bd_pins FIR_Q_2/aclk]
connect_bd_net [get_bd_pins aclk] [get_bd_pins axi_gpio_FILTER_GAIN/s_axi_aclk]
connect_bd_net -net aresetn1_1 [get_bd_pins aresetn1] [get_bd_pins axi_gpio_FILTER_GAIN/s_axi_aresetn]
connect_bd_net [get_bd_pins aresetn] \
  [get_bd_pins axi_interface_DEC_RATE_Q/ctrl_s_axi_aresetn] [get_bd_pins axi_interface_DEC_RATE_I/ctrl_m_axis_aresetn] \
  [get_bd_pins axi_interface_DEC_RATE_I/ctrl_s_axi_aresetn]
connect_bd_net [get_bd_pins axi_gpio_FILTER_GAIN/gpio_io_o] [get_bd_pins mult_by_GAIN_Q/B] [get_bd_pins mult_by_GAIN_I/B]
connect_bd_net -net mult_by_4_I_P [get_bd_pins mult_by_GAIN_I/P] [get_bd_pins FIR_Q_2/s_axis_data_tdata]
connect_bd_net -net mult_by_4_Q_P [get_bd_pins mult_by_GAIN_Q/P] [get_bd_pins FIR_I_2/s_axis_data_tdata]
connect_bd_net -net s_axis_data_tvalid_1 [get_bd_pins xlconstant_0/dout] \
  [get_bd_pins CIC_I_1024/s_axis_data_tvalid] [get_bd_pins CIC_Q_1024/s_axis_data_tvalid]
connect_bd_net [get_bd_pins xlconstant_2/dout] [get_bd_pins axi_interface_DEC_RATE_Q/ctrl_m_axis_aresetn]

current_bd_instance /I2S
connect_bd_net -net AM_demodulator_U [get_bd_pins In1] [get_bd_pins xlconcat_0/In1] [get_bd_pins xlconcat_0/In0]
connect_bd_net -net DivideBy2_clk_out [get_bd_pins DivideBy10/clk_out] [get_bd_pins I2S_Transmitter_0/mclk]
connect_bd_net [get_bd_pins I2S_Transmitter_0/bclk] [get_bd_pins SCLK]
connect_bd_net [get_bd_pins I2S_Transmitter_0/lrclk] [get_bd_pins LRCLK]
connect_bd_net [get_bd_pins I2S_Transmitter_0/sdata] [get_bd_pins I2SDATA]
connect_bd_net -net PS_ARESETN [get_bd_pins s00_axis_aresetn] [get_bd_pins I2S_Transmitter_0/s00_axis_aresetn] [get_bd_pins DivideBy10/resetn]
connect_bd_net -net PS_FCLK_CLK0 [get_bd_pins s00_axis_aclk] [get_bd_pins I2S_Transmitter_0/s00_axis_aclk] [get_bd_pins DivideBy10/clk]
connect_bd_net [get_bd_pins xlconcat_0/dout] [get_bd_pins I2S_Transmitter_0/s00_axis_tdata]
connect_bd_net [get_bd_pins xlconstant_1/dout] [get_bd_pins I2S_Transmitter_0/s00_axis_tvalid]

current_bd_instance /HDMI
connect_bd_intf_net [get_bd_intf_pins S_AXI1] [get_bd_intf_pins axi_gpio_0/S_AXI]
connect_bd_intf_net [get_bd_intf_pins M00_AXI1] [get_bd_intf_pins axi_interconnect_1/M00_AXI]
connect_bd_intf_net [get_bd_intf_pins S_AXI_LITE] [get_bd_intf_pins axi_vdma_0/S_AXI_LITE]
connect_bd_intf_net [get_bd_intf_pins ctrl] [get_bd_intf_pins v_tc_0/ctrl]
connect_bd_intf_net [get_bd_intf_pins s00_axi] [get_bd_intf_pins axi_dynclk_0/s00_axi]
connect_bd_intf_net [get_bd_intf_pins S_AXI] [get_bd_intf_pins axi_gpio_hdmi/S_AXI]
connect_bd_intf_net [get_bd_intf_pins HDMI_HPD] [get_bd_intf_pins axi_gpio_hdmi/GPIO]
connect_bd_intf_net [get_bd_intf_pins axi_vdma_0/M_AXIS_MM2S] [get_bd_intf_pins axis_subset_converter_0/S_AXIS]
connect_bd_intf_net [get_bd_intf_pins axi_vdma_0/M_AXI_MM2S] [get_bd_intf_pins axi_interconnect_1/S00_AXI]
connect_bd_intf_net [get_bd_intf_pins axis_subset_converter_0/M_AXIS] [get_bd_intf_pins v_axi4s_vid_out_0/video_in]
connect_bd_intf_net [get_bd_intf_pins rgb2dvi_0/RGB] [get_bd_intf_pins v_axi4s_vid_out_0/vid_io_out]
connect_bd_intf_net [get_bd_intf_pins v_tc_0/vtiming_out] [get_bd_intf_pins v_axi4s_vid_out_0/vtiming_in]
connect_bd_net [get_bd_pins m_axis_mm2s_aclk] \
  [get_bd_pins axi_vdma_0/m_axi_mm2s_aclk] [get_bd_pins axi_vdma_0/m_axis_mm2s_aclk] \
  [get_bd_pins axis_subset_converter_0/aclk] [get_bd_pins axi_interconnect_1/ACLK] [get_bd_pins axi_interconnect_1/M00_ACLK] \
  [get_bd_pins axi_interconnect_1/S00_ACLK] [get_bd_pins v_axi4s_vid_out_0/aclk]
connect_bd_net -net PS_ARESETN [get_bd_pins s_axi_aresetn] \
  [get_bd_pins axi_dynclk_0/s00_axi_aresetn] [get_bd_pins axi_gpio_hdmi/s_axi_aresetn] [get_bd_pins axi_vdma_0/axi_resetn] \
  [get_bd_pins axi_gpio_0/s_axi_aresetn]
connect_bd_net -net PS_FCLK_CLK0 [get_bd_pins s_axi_aclk] \
  [get_bd_pins axi_dynclk_0/s00_axi_aclk] [get_bd_pins axi_dynclk_0/REF_CLK_I] [get_bd_pins axi_gpio_hdmi/s_axi_aclk] \
  [get_bd_pins axi_vdma_0/s_axi_lite_aclk] [get_bd_pins axi_gpio_0/s_axi_aclk]
connect_bd_net -net PS_FCLK_CLK1 [get_bd_pins ADC_clk_64M] [get_bd_pins v_tc_0/s_axi_aclk]
connect_bd_net [get_bd_pins axi_dynclk_0/LOCKED_O] [get_bd_pins rgb2dvi_0/aRst_n]
connect_bd_net [get_bd_pins axi_dynclk_0/PXL_CLK_5X_O] [get_bd_pins rgb2dvi_0/SerialClk]
connect_bd_net [get_bd_pins axi_dynclk_0/PXL_CLK_O] \
  [get_bd_pins rgb2dvi_0/PixelClk] [get_bd_pins v_tc_0/clk] [get_bd_pins v_axi4s_vid_out_0/vid_io_out_clk]
connect_bd_net [get_bd_pins axi_gpio_0/ip2intc_irpt] [get_bd_pins xlconcat_IRQ/In3]
connect_bd_net [get_bd_pins axi_gpio_hdmi/ip2intc_irpt] [get_bd_pins xlconcat_IRQ/In2]
connect_bd_net [get_bd_pins axi_vdma_0/mm2s_introut] [get_bd_pins xlconcat_IRQ/In1]
connect_bd_net [get_bd_pins gpio2_io_i] [get_bd_pins axi_gpio_0/gpio2_io_i]
connect_bd_net [get_bd_pins gpio_io_i] [get_bd_pins axi_gpio_0/gpio_io_i]
connect_bd_net [get_bd_pins rgb2dvi_0/TMDS_Clk_n] [get_bd_pins TMDS_Clk_n_0]
connect_bd_net [get_bd_pins rgb2dvi_0/TMDS_Clk_p] [get_bd_pins TMDS_Clk_p_0]
connect_bd_net [get_bd_pins rgb2dvi_0/TMDS_Data_n] [get_bd_pins TMDS_Data_n_0]
connect_bd_net [get_bd_pins rgb2dvi_0/TMDS_Data_p] [get_bd_pins TMDS_Data_p_0]
connect_bd_net -net rst_ps7_0_140M_peripheral_aresetn [get_bd_pins ARESETN] \
  [get_bd_pins axis_subset_converter_0/aresetn] [get_bd_pins axi_interconnect_1/ARESETN] \
  [get_bd_pins axi_interconnect_1/S00_ARESETN] [get_bd_pins axi_interconnect_1/M00_ARESETN]
connect_bd_net -net rst_ps7_0_64M_peripheral_aresetn [get_bd_pins s_axi_aresetn1] [get_bd_pins v_tc_0/s_axi_aresetn]
connect_bd_net [get_bd_pins v_axi4s_vid_out_0/vtg_ce] [get_bd_pins v_tc_0/gen_clken]
connect_bd_net [get_bd_pins v_tc_0/irq] [get_bd_pins xlconcat_IRQ/In0]
connect_bd_net [get_bd_pins xlconcat_IRQ/dout] [get_bd_pins dout]
connect_bd_net [get_bd_pins xlconstant_0/dout] [get_bd_pins HDMI_OEN]
